# EAGLE design universal_level_converter (EAGLE 7.4.0)
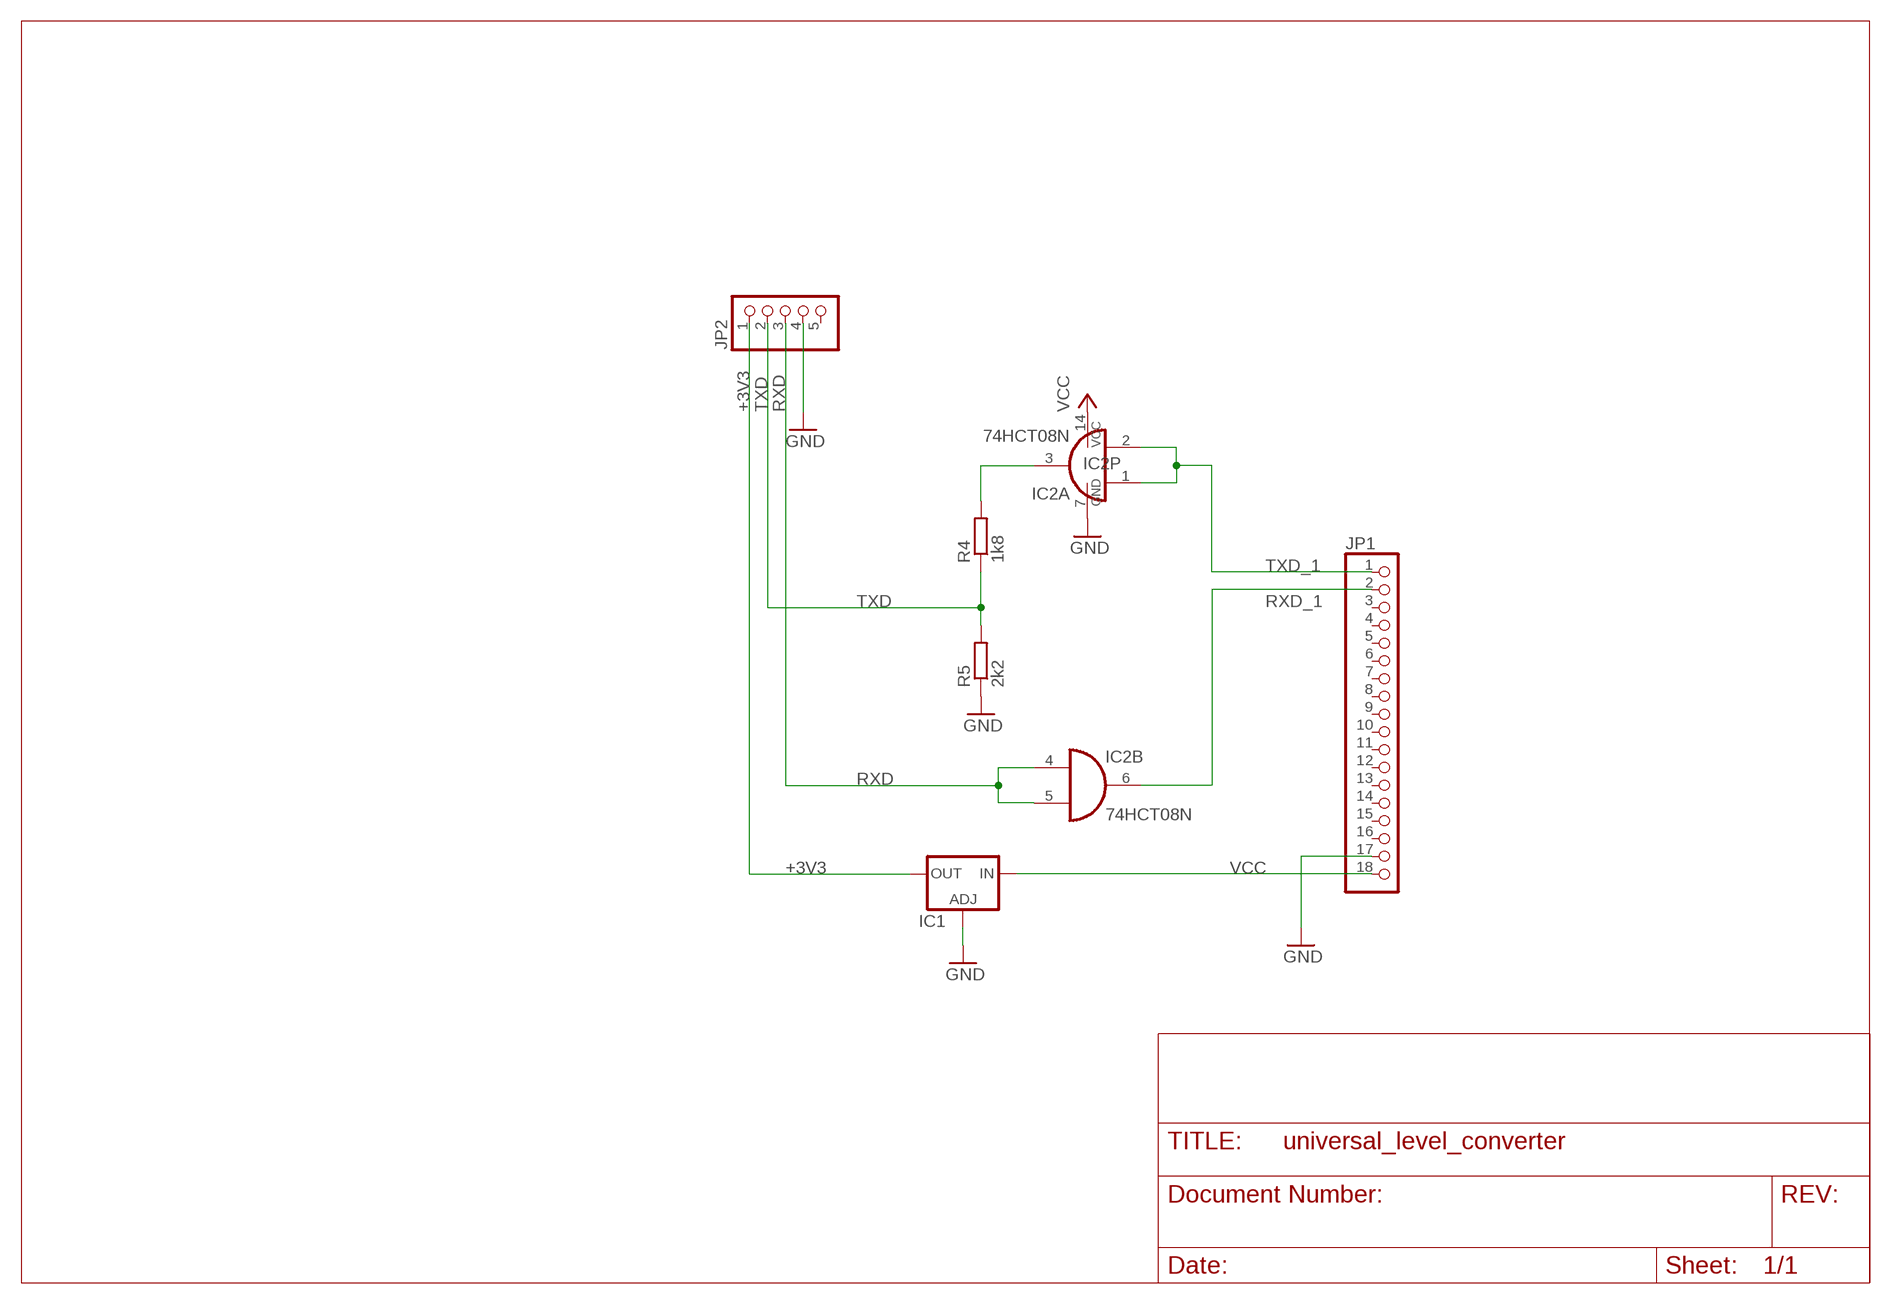
[diagram p0: schematic, sheet 1]

## Parts
IC1  LM138-TL  [TO220L1]
IC2  74HCT08N  [DIL14]
JP1  PINHD-1X18  [1X18]
JP2  PINHD-1X5  [1X05]
R4  1k8  R-EU_0207/10  [0207/10]
R5  2k2  R-EU_0207/10  [0207/10]

## Nets
+3V3: IC1.2(OUT) JP2.1
GND: IC1.1(ADJ) IC2.7(P:GND) JP1.17 JP2.4 R5.1
N$9: IC2.3(A:O) R4.2
RXD: IC2.4(B:I0) IC2.5(B:I1) JP2.3
RXD_1: IC2.6(B:O) JP1.2
TXD: JP2.2 R4.1 R5.2
TXD_1: IC2.1(A:I0) IC2.2(A:I1) JP1.1
VCC: IC1.3(IN) IC2.14(P:VCC) JP1.18
Unconnected: IC2.8(C:O) IC2.9(C:I0) IC2.10(C:I1) IC2.11(D:O) IC2.12(D:I0) IC2.13(D:I1) JP1.3 JP1.4 JP1.5 JP1.6 JP1.7 JP1.8 JP1.9 JP1.10 JP1.11 JP1.12 JP1.13 JP1.14 JP1.15 JP1.16 JP2.5

## Library data of the parts
IC1 = v-reg:LM138-TL: VOLTAGE REGULATOR
IC2 = 74xx-eu:74*08: Quad 2-input AND gate
JP1 = pinhead:PINHD-1X18: PIN HEADER
JP2 = pinhead:PINHD-1X5: PIN HEADER
R4 R5 = rcl:R-EU_: RESISTOR, European symbol

## Board
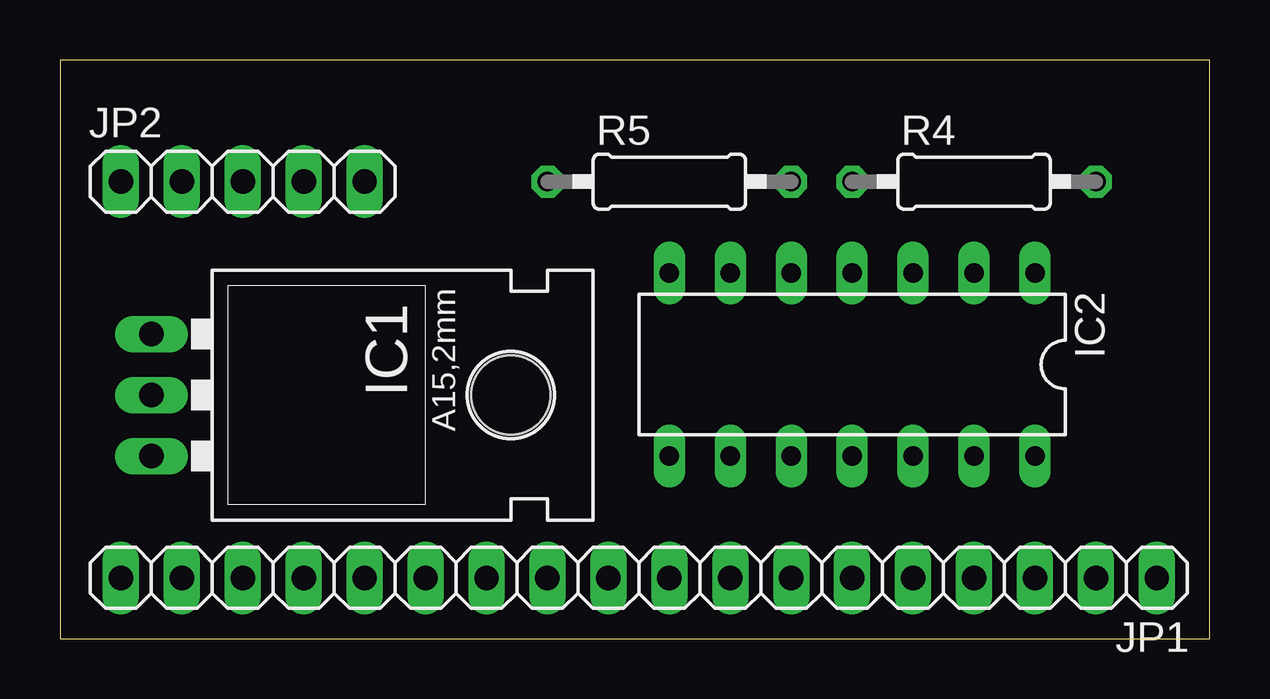
[diagram p1: board, top side]
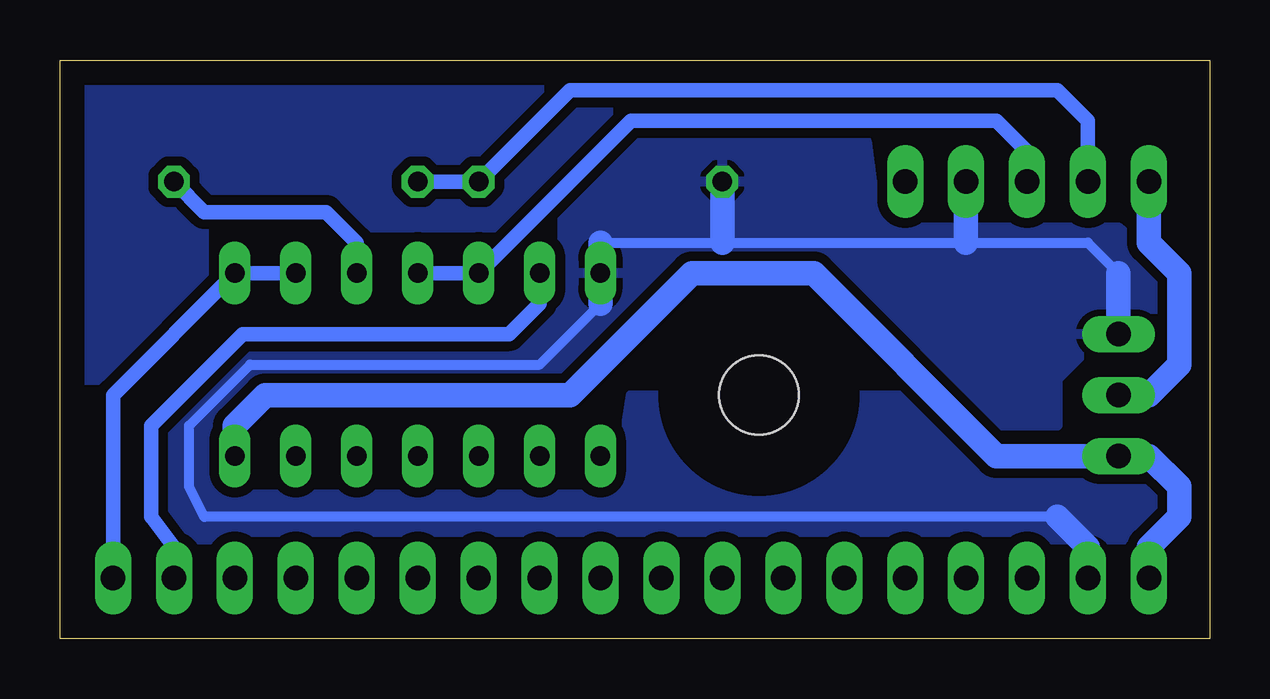
[diagram p2: board, bottom side, seen from below]

Size 47.93 x 24.12 mm. Coordinates in mm from the lower left corner, seen from the top.
Outline: 0,0 47.93,0 47.93,24.12 0,24.12 0,0
Copper layers (1*16): Top 0.035mm / dielectric 1.5mm / Bottom 0.035mm
Design rules "default *": minimum track width 10mil, minimum drill 24mil, track to track 0.4mm, track to pad 0.4mm, pad to pad 0.2mm, via to via 0.2mm, smd to smd 0.2mm, copper to edge 40mil, drill to drill 8mil, minimum pad ring 10mil, minimum via ring 8mil, stop-mask expansion 4mil, vias tented up to drill 0mil, thermal gap 10mil

### Footprints (pad centres in the part's own frame; a part is rotated, then mirrored left to right if it is on the bottom)
TO220L1 = drill 1.016 long: 1 -2.54,-3.81; 2 0,-3.81; 3 2.54,-3.81 | hole 3.302: 0,11.176
DIL14 = drill 0.813 long: 1 -7.62,-3.81; 2 -5.08,-3.81; 3 -2.54,-3.81; 4 0,-3.81; 5 2.54,-3.81; 6 5.08,-3.81; 7 7.62,-3.81; 8 7.62,3.81; 9 5.08,3.81; 10 2.54,3.81; 11 0,3.81; 12 -2.54,3.81; 13 -5.08,3.81; 14 -7.62,3.81
1X18 = drill 1.016 long: 1 -21.59,0; 2 -19.05,0; 3 -16.51,0; 4 -13.97,0; 5 -11.43,0; 6 -8.89,0; 7 -6.35,0; 8 -3.81,0; 9 -1.27,0; 10 1.27,0; 11 3.81,0; 12 6.35,0; 13 8.89,0; 14 11.43,0; 15 13.97,0; 16 16.51,0; 17 19.05,0; 18 21.59,0
1X05 = drill 1.016 long: 1 -5.08,0; 2 -2.54,0; 3 0,0; 4 2.54,0; 5 5.08,0
0207/10 = drill 0.813 octagon: 1 -5.08,0; 2 5.08,0

### Placement (x,y rotation side)
IC1  7.62,10.16 270 top
IC2  33.02,11.43 180 top
JP1  24.13,2.54 180 top
JP2  7.62,19.05 0 top
R4  38.1,19.05 0 top
R5  25.4,19.05 0 top

### Tracks (layer width: path | path; a pad name or v marks a point on that pad's centre or on a via)
+3V3
  Bottom 1.016: IC1.2 2.54,10.16 1.27,11.43 1.27,15.24 2.54,16.51 JP2.1
GND
  Bottom 0.406: 3.81,15.24 5.08,16.51 10.16,16.51 20.32,16.51 25.4,16.51 | 6.35,5.08 41.91,5.08 42.55,6.35 42.55,8.89 40.01,11.43 27.94,11.43 25.4,13.97
  Bottom 1.016: JP2.4 10.16,16.51 | R5.1 20.32,16.51 | IC1.1 3.81,15.24 | JP1.17 5.08,3.81 6.35,5.08 | 25.4,13.97 IC2.7 25.4,16.51
  pour Bottom: 2.54,4.13 6.67,4.13 6.99,4.45 44.45,4.45 44.45,6.03 24.77,6.03 24.13,10.16 11.43,10.16 8.89,7.62 2.54,7.62 1.27,6.35 1.27,5.08
  pour Bottom: 41.27,4.13 44.13,4.13 44.13,8.89 40.32,12.7 29.21,12.7 26.99,14.92 26.99,18.41 23.81,21.59 14.61,21.59 14.29,20.64 13.97,18.1 13.02,17.14 3.81,17.14 1.59,15.24 1.59,13.97 2.22,13.34 5.08,13.34 5.08,12.06 6.35,10.79 6.35,8.89 10.16,8.89 16.51,15.24 21.91,15.24 21.91,14.92 26.67,10.16 39.05,10.16 40.96,8.26 40.96,4.45
GND2
  pour Bottom: 24.13,24.13 47.62,24.13 47.62,10.79 45.72,10.79 41.91,13.97 41.91,17.14 28.57,17.14 24.13,21.59
N$9
  Bottom 0.61: IC2.3 35.56,16.51 36.83,17.78 41.91,17.78 R4.2
RXD
  Bottom 0.61: IC2.4 IC2.5 24.13,21.59 8.89,21.59 7.62,20.32 JP2.3
RXD_1
  Bottom 0.61: JP1.2 43.18,3.81 44.13,5.08 44.13,8.89 40.32,12.7 29.21,12.7 27.94,13.97 IC2.6
TXD
  Bottom 0.61: R4.1 R5.2 26.67,22.86 6.35,22.86 5.08,21.59 JP2.2
TXD_1
  Bottom 0.61: JP1.1 45.72,10.16 IC2.1 IC2.2
VCC
  Bottom 1.016: IC2.14 40.64,8.89 39.37,10.16 26.67,10.16 21.59,15.24 16.51,15.24 8.89,7.62 IC1.3 2.54,7.62 1.27,6.35 1.27,5.08 2.54,3.81 JP1.18